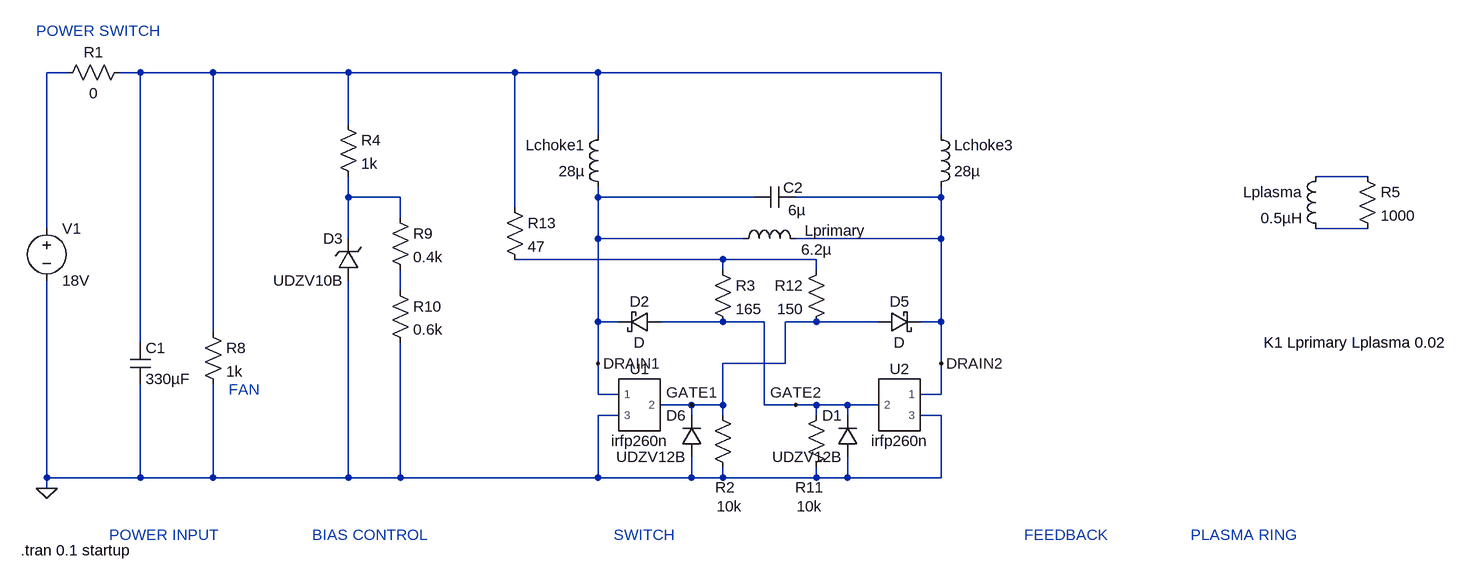
[diagram p0: schematic DualFETZVS-LowFreq.asc]
DualFETZVS-LowFreq.asc, the LTspice schematic file:
Version 4.1
SHEET 1 2388 680
WIRE 128 -432 96 -432
WIRE 240 -432 208 -432
WIRE 352 -432 240 -432
WIRE 560 -432 352 -432
WIRE 816 -432 560 -432
WIRE 944 -432 816 -432
WIRE 1472 -432 944 -432
WIRE 560 -352 560 -432
WIRE 944 -336 944 -432
WIRE 1472 -336 1472 -432
WIRE 2128 -272 2048 -272
WIRE 560 -240 560 -272
WIRE 640 -240 560 -240
WIRE 944 -240 944 -256
WIRE 1184 -240 944 -240
WIRE 1472 -240 1472 -256
WIRE 1472 -240 1248 -240
WIRE 816 -224 816 -432
WIRE 640 -208 640 -240
WIRE 96 -192 96 -432
WIRE 2128 -192 2048 -192
WIRE 560 -176 560 -240
WIRE 944 -176 944 -240
WIRE 1168 -176 944 -176
WIRE 1472 -176 1472 -240
WIRE 1472 -176 1248 -176
WIRE 1136 -144 816 -144
WIRE 1280 -144 1136 -144
WIRE 1136 -128 1136 -144
WIRE 1280 -128 1280 -144
WIRE 640 -96 640 -128
WIRE 944 -48 944 -176
WIRE 976 -48 944 -48
WIRE 1136 -48 1040 -48
WIRE 1200 -48 1136 -48
WIRE 1280 -48 1232 -48
WIRE 1376 -48 1280 -48
WIRE 1472 -48 1472 -176
WIRE 1472 -48 1440 -48
WIRE 352 -32 352 -432
WIRE 240 -16 240 -432
WIRE 944 16 944 -48
WIRE 1232 16 1232 -48
WIRE 1232 16 1136 16
WIRE 1472 16 1472 -48
WIRE 944 64 944 16
WIRE 976 64 944 64
WIRE 1472 64 1472 16
WIRE 1472 64 1440 64
WIRE 1088 80 1040 80
WIRE 1136 80 1136 16
WIRE 1136 80 1088 80
WIRE 1200 80 1200 -48
WIRE 1248 80 1200 80
WIRE 1280 80 1248 80
WIRE 1328 80 1280 80
WIRE 1376 80 1328 80
WIRE 976 96 944 96
WIRE 1088 96 1088 80
WIRE 1136 96 1136 80
WIRE 1280 96 1280 80
WIRE 1328 96 1328 80
WIRE 1472 96 1440 96
WIRE 96 192 96 -112
WIRE 240 192 240 48
WIRE 240 192 96 192
WIRE 352 192 352 48
WIRE 352 192 240 192
WIRE 560 192 560 -112
WIRE 560 192 352 192
WIRE 640 192 640 -16
WIRE 640 192 560 192
WIRE 944 192 944 96
WIRE 944 192 640 192
WIRE 1088 192 1088 160
WIRE 1088 192 944 192
WIRE 1136 192 1136 176
WIRE 1136 192 1088 192
WIRE 1280 192 1280 176
WIRE 1280 192 1136 192
WIRE 1328 192 1328 160
WIRE 1328 192 1280 192
WIRE 1472 192 1472 96
WIRE 1472 192 1328 192
WIRE 96 208 96 192
FLAG 96 208 0
FLAG 1088 80 GATE1
FLAG 944 16 DRAIN1
FLAG 1248 80 GATE2
FLAG 1472 16 DRAIN2
SYMBOL voltage 96 -208 R0
WINDOW 123 0 0 Left 0
WINDOW 39 0 0 Left 0
SYMATTR InstName V1
SYMATTR Value 18V
SYMBOL res 224 -448 R90
WINDOW 0 0 56 VBottom 2
WINDOW 3 32 56 VTop 2
SYMATTR InstName R1
SYMATTR Value 0
SYMBOL cap 224 -16 R0
SYMATTR InstName C1
SYMATTR Value 330µF
SYMBOL ind 1152 -160 R270
WINDOW 0 13 157 VTop 2
WINDOW 3 15 128 VBottom 2
SYMATTR InstName Lprimary
SYMATTR Value 6.2µ
SYMATTR SpiceLine Rser=16m
SYMBOL ind 2064 -288 M0
SYMATTR InstName Lplasma
SYMATTR Value 0.5µH
SYMBOL res 336 -48 R0
SYMATTR InstName R8
SYMATTR Value 1k
SYMBOL res 2112 -288 R0
SYMATTR InstName R5
SYMATTR Value 1000
SYMBOL irfp260n 1008 80 M0
SYMATTR InstName U1
SYMBOL ind 960 -240 R180
WINDOW 0 36 80 Left 2
WINDOW 3 36 40 Left 2
SYMATTR InstName Lchoke1
SYMATTR Value 28µ
SYMATTR SpiceLine Rser=16m
SYMBOL zener 576 -112 R180
WINDOW 0 24 64 Left 2
WINDOW 3 24 0 Left 2
SYMATTR InstName D3
SYMATTR Value UDZV10B
SYMBOL res 544 -368 R0
SYMATTR InstName R4
SYMATTR Value 1k
SYMBOL res 624 -224 R0
SYMATTR InstName R9
SYMATTR Value 0.4k
SYMBOL res 624 -112 R0
SYMATTR InstName R10
SYMATTR Value 0.6k
SYMBOL cap 1248 -256 R90
WINDOW 0 17 4 VBottom 2
WINDOW 3 20 -2 VTop 2
SYMATTR InstName C2
SYMATTR Value 6µ
SYMBOL res 1120 80 R0
WINDOW 0 4 127 Left 2
WINDOW 3 7 156 Left 2
SYMATTR InstName R2
SYMATTR Value 10k
SYMBOL schottky 1040 -64 R90
WINDOW 0 0 32 VBottom 2
WINDOW 3 32 32 VTop 2
SYMATTR InstName D2
SYMBOL res 1120 -144 R0
SYMATTR InstName R3
SYMATTR Value 165
SYMBOL irfp260n 1408 80 R0
SYMATTR InstName U2
SYMBOL ind 1456 -240 M180
WINDOW 0 36 80 Left 2
WINDOW 3 36 40 Left 2
SYMATTR InstName Lchoke3
SYMATTR Value 28µ
SYMATTR SpiceLine Rser=16m
SYMBOL res 1296 80 M0
WINDOW 0 4 127 Left 2
WINDOW 3 7 156 Left 2
SYMATTR InstName R11
SYMATTR Value 10k
SYMBOL schottky 1376 -64 M90
WINDOW 0 0 32 VBottom 2
WINDOW 3 32 32 VTop 2
SYMATTR InstName D5
SYMBOL res 1296 -144 M0
SYMATTR InstName R12
SYMATTR Value 150
SYMBOL res 800 -240 R0
SYMATTR InstName R13
SYMATTR Value 47
SYMBOL diode 1104 160 R180
WINDOW 0 24 64 Left 2
WINDOW 3 24 0 Left 2
SYMATTR InstName D6
SYMATTR Value UDZV12B
SYMATTR Description Diode
SYMATTR Type diode
SYMBOL diode 1344 160 R180
WINDOW 0 24 64 Left 2
WINDOW 3 24 0 Left 2
SYMATTR InstName D1
SYMATTR Value UDZV12B
SYMATTR Description Diode
SYMATTR Type diode
TEXT 80 -496 Left 2 ;POWER SWITCH
TEXT 376 56 Left 2 ;FAN
TEXT 1968 -16 Left 2 !K1 Lprimary Lplasma 0.02
TEXT 1856 280 Left 2 ;PLASMA RING
TEXT 192 280 Left 2 ;POWER INPUT
TEXT 504 280 Left 2 ;BIAS CONTROL
TEXT 968 280 Left 2 ;SWITCH
TEXT 1600 280 Left 2 ;FEEDBACK
TEXT 56 304 Left 2 !.tran 0.1 startup

The netlist it stands for:
* DualFETZVS-LowFreq.asc
V1 N001 0 18V
R1 N002 N001 0
C1 N002 0 330µF
Lprimary DRAIN1 DRAIN2 6.2µ Rser=16m
Lplasma N003 N005 0.5µH
R8 N002 0 1k
R5 N003 N005 1000
X§U1 DRAIN1 GATE1 0 irfp260n  ; pins 1 2 3
Lchoke1 DRAIN1 N002 28µ Rser=16m
D3 0 N004 UDZV10B
R4 N002 N004 1k
R9 N004 N007 0.4k
R10 N007 0 0.6k
C2 DRAIN2 DRAIN1 6µ
R2 GATE1 0 10k
D2 GATE2 DRAIN1 D
R3 N006 GATE2 165
X§U2 DRAIN2 GATE2 0 irfp260n  ; pins 1 2 3
Lchoke3 DRAIN2 N002 28µ Rser=16m
R11 GATE2 0 10k
D5 GATE1 DRAIN2 D
R12 N006 GATE1 150
R13 N002 N006 47
D6 0 GATE1 UDZV12B
D1 0 GATE2 UDZV12B
.model D D
.lib standard.dio
* POWER SWITCH
* FAN
K1 Lprimary Lplasma 0.02
* PLASMA RING
* POWER INPUT
* BIAS CONTROL
* SWITCH
* FEEDBACK
.tran 0.1 startup
.lib C:\Users\userl\Downloads\irfp260n.spi
.backanno
.end